# EAGLE schematic subpar-igbt-driver (EAGLE 9.5.0)
COMPANY: SubparEV; CREVISION: 0.0; DESIGNER: Rafael Silva; LICENSE: GNU General Public License v3.0; LINK: https://github.com/SubparEV/subpar-igbt-driver
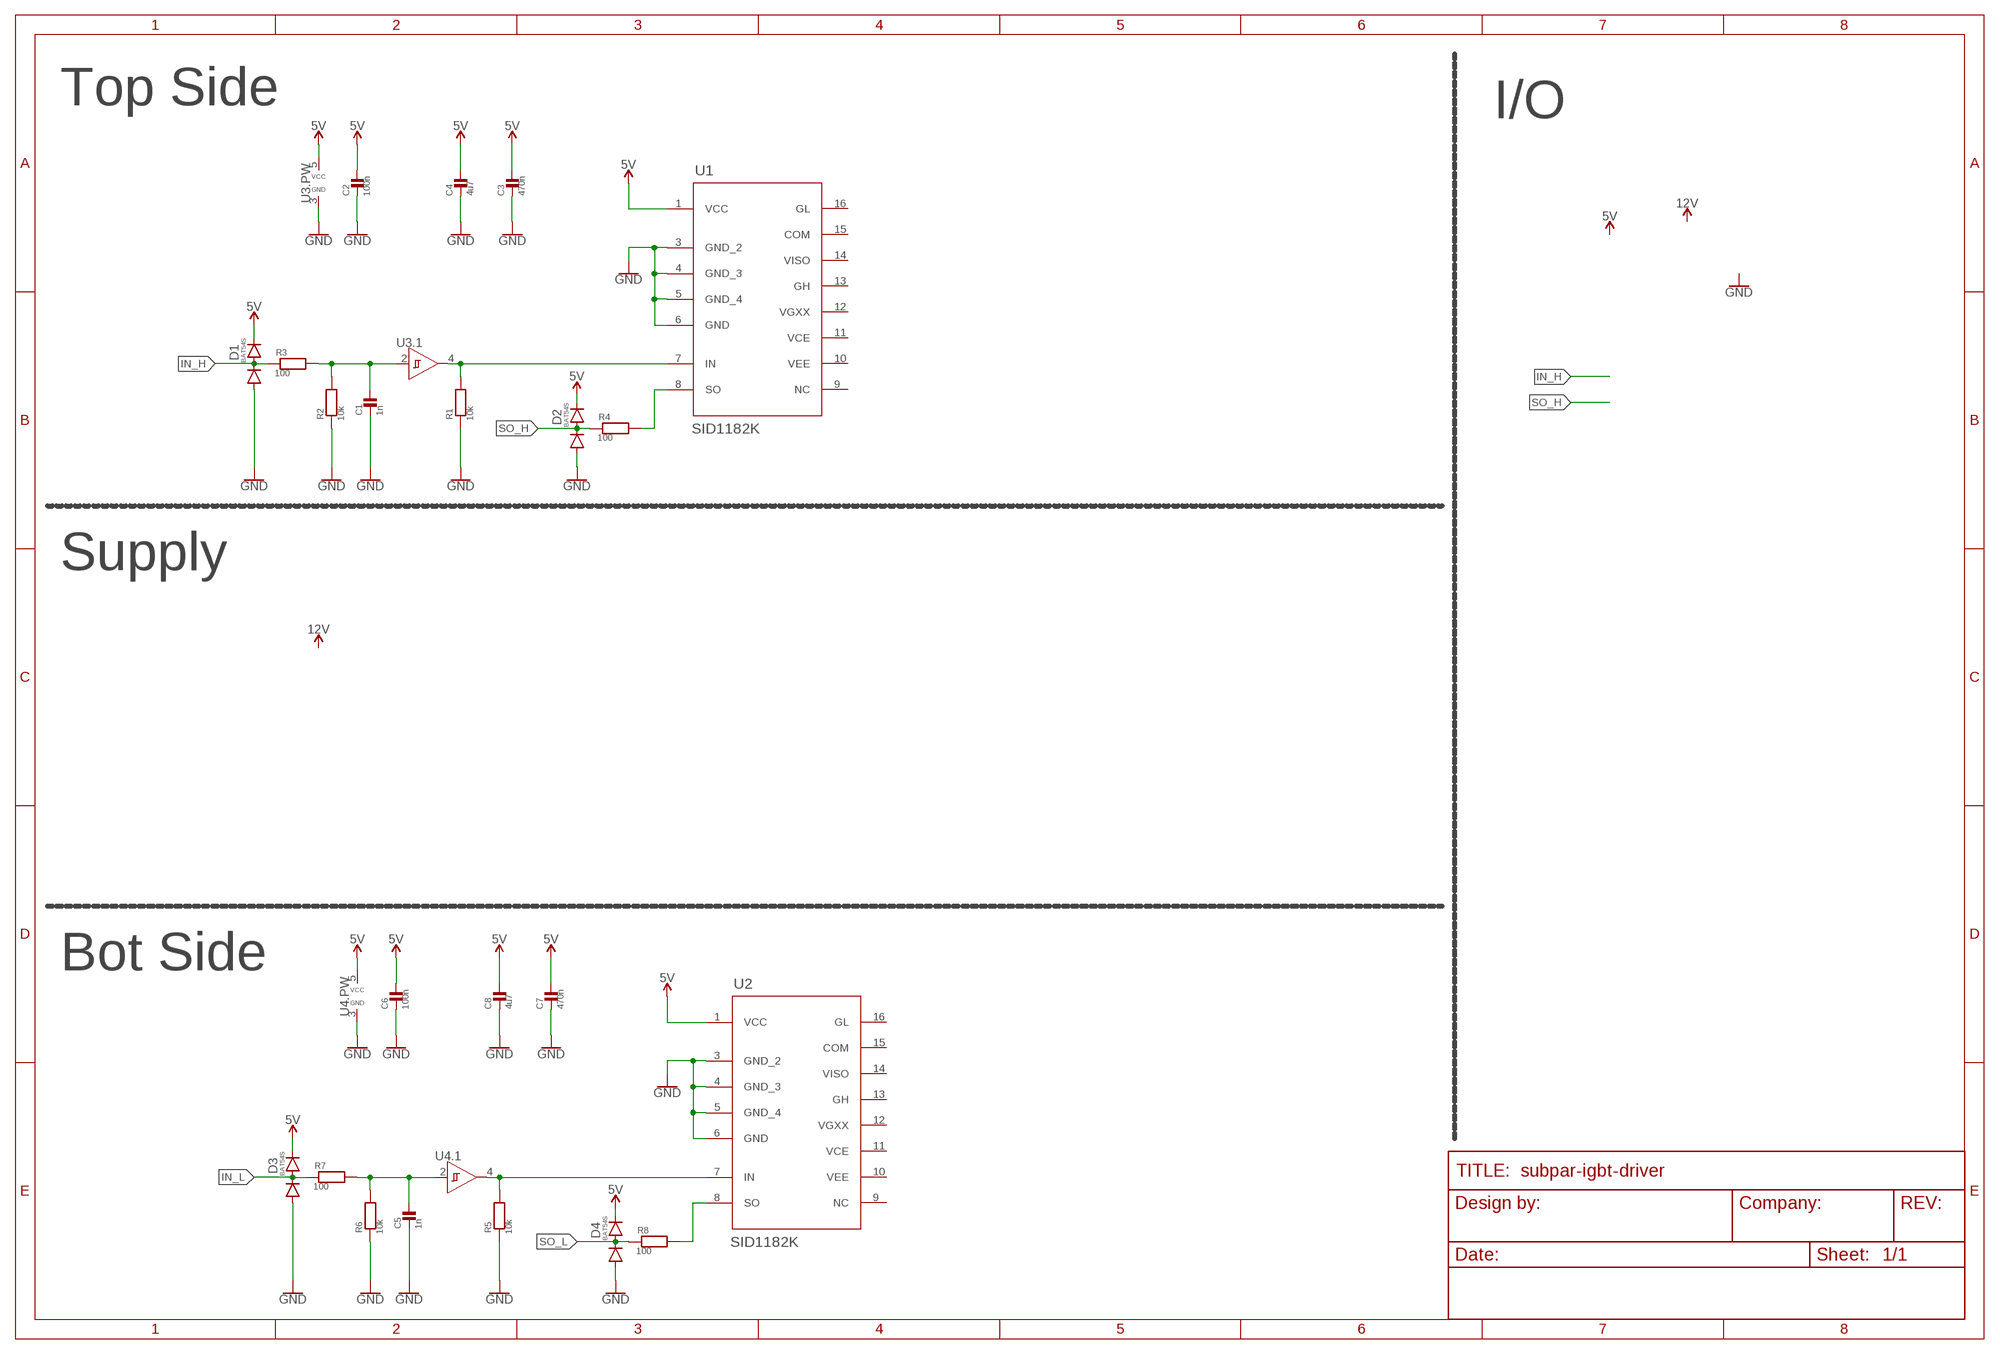
[diagram p0: schematic, sheet 1]

## Parts
C1  1n  MLCC0603  [0603_WAVE]
C2  100n  MLCC0603  [0603_WAVE]
C3  470n  MLCC0603  [0603_WAVE]
C4  4u7  MLCC0603  [0603_WAVE]
C5  1n  MLCC0603  [0603_WAVE]
C6  100n  MLCC0603  [0603_WAVE]
C7  470n  MLCC0603  [0603_WAVE]
C8  4u7  MLCC0603  [0603_WAVE]
D1  BAT54S  [SOT-23-3]
D2  BAT54S  [SOT-23-3]
D3  BAT54S  [SOT-23-3]
D4  BAT54S  [SOT-23-3]
R1  10k  RESISTOR0603  [0603_WAVE]
R2  10k  RESISTOR0603  [0603_WAVE]
R3  100  RESISTOR0603  [0603_WAVE]
R4  100  RESISTOR0603  [0603_WAVE]
R5  10k  RESISTOR0603  [0603_WAVE]
R6  10k  RESISTOR0603  [0603_WAVE]
R7  100  RESISTOR0603  [0603_WAVE]
R8  100  RESISTOR0603  [0603_WAVE]
U1  SID1182K  [ESOP-R16B]
U2  SID1182K  [ESOP-R16B]
U3  74LVC1G17  [SC70-5]
U4  74LVC1G17  [SC70-5]

## Nets
5V: C2.P$1 C3.P$1 C4.P$1 C6.P$1 C7.P$1 C8.P$1 D1.P$2 D2.P$2 D3.P$2 D4.P$2 U1.1(VCC) U2.1(VCC) U3.5(.PW:VCC) U4.5(.PW:VCC)
GND: C1.P$2 C2.P$2 C3.P$2 C4.P$2 C5.P$2 C6.P$2 C7.P$2 C8.P$2 D1.P$1 D2.P$1 D3.P$1 D4.P$1 R1.P$1 R2.P$1 R5.P$1 R6.P$1 U1.3(GND_2) U1.4(GND_3) U1.5(GND_4) U1.6(GND) U2.3(GND_2) U2.4(GND_3) U2.5(GND_4) U2.6(GND) U3.3(.PW:GND) U4.3(.PW:GND)
IN_H: D1.P$3 R3.P$1
IN_L: D3.P$3 R7.P$1
N$1: R1.P$2 U1.7(IN) U3.4(.1:Y)
N$2: C1.P$1 R2.P$2 R3.P$2 U3.2(.1:A)
N$3: R4.P$2 U1.8(SO)
N$4: R5.P$2 U2.7(IN) U4.4(.1:Y)
N$5: C5.P$1 R6.P$2 R7.P$2 U4.2(.1:A)
N$6: R8.P$2 U2.8(SO)
SO_H: D2.P$3 R4.P$1
SO_L: D4.P$3 R8.P$1
Unconnected: U1.9(NC) U1.10(VEE) U1.11(VCE) U1.12(VGXX) U1.13(GH) U1.14(VISO) U1.15(COM) U1.16(GL) U2.9(NC) U2.10(VEE) U2.11(VCE) U2.12(VGXX) U2.13(GH) U2.14(VISO) U2.15(COM) U2.16(GL)

## Notes on the sheet
- Top Side | I/O
- Supply
- Bot Side

## Library data of the parts
C1-C8 = Passive Components > Capacitors > Multilayer Ceramic Capacitors MLCC:MLCC: KEMET’s X7R dielectric features a 125°C maximum operating temperature and is considered temperature stable. The Electronics Components, Assemblies and Materials Association (EIA) characterizes X7R dielectric as a Class II material. Components of this classification are fixed, ceramic dielectric capacitors suited for bypass and decoupling applications or for frequency discriminating circuits where Q and stability of capacitance characteristics are not critical. X7R exhibits a predictable change in capacitance with respect to time and voltage, boasting a minimal change in capacitance with reference to ambient temperature. Capacitance change is limited to ±15% from −55°C to +125°C.
D1-D4 = Semiconductors > Discrete Semiconductors > Diodes & Rectifiers > Schottky Diodes & Rectifiers:BAT54S
R1-R8 = Passive Components > Resistors > Chip Resistors:RESISTOR: Resistors For new designs, use the packages preceded by an '_' character since they are more reliable: The following footprints should be used on most boards: _0402 - Standard footprint for regular board layouts _0603 - Standard footprint for regular board layouts _0805 - Standard footprint for regular board layouts _1206 - Standard footprint for regular board layouts For extremely tight-pitch boards where space is at a premium, the following 'micro-pitch' footprints can be used (smaller pads, no silkscreen outline, etc.): _0402MP - Micro-pitch footprint for very dense/compact boards _0603MP - Micro-pitch footprint for very dense/compact boards _0805MP - Micro-pitch footprint for very dense/compact boards _1206MP - Micro-pitch footprint for very dense/compact boards
U1 U2 = Power > Gate Drivers:SID1182K; MANUFACTURER_PART_NUMBER: SID1182K; VENDOR: Power Integrations
U3 U4 = Semiconductors > Integrated Circuits - ICs > Logic ICs > Logic Gates:74LVC1G17